# Altium schematic sheet Interface_RS485.SchDoc
size 114 x 55 mm
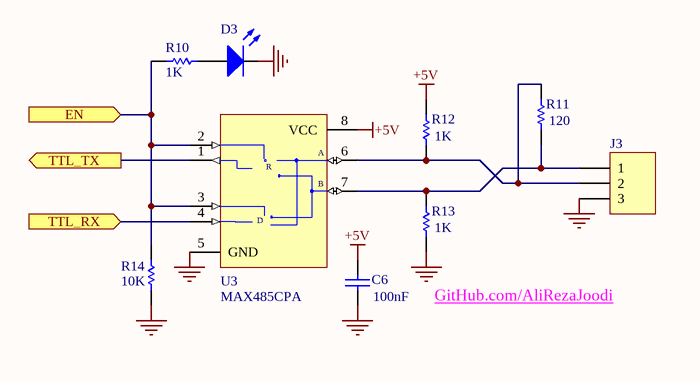
[diagram p0: Interface_RS485.SchDoc]

## Parts
C6  value 100nF  [CAPNTO2.54-3.05x1.78A]  (hidden comment: Cap)
D3  LED  [LED-5mm_Red]  (value not drawn)
J3  Header 3  [Fonics_3PIN_1]  (value not drawn)
R10  value 1K  [AXIAL-0.4]  (hidden comment: Resistor)
R11  value 120  [AXIAL-0.4]  (hidden comment: Res1)
R12  value 1K  [AXIAL-0.4]  (hidden comment: Res1)
R13  value 1K  [AXIAL-0.4]  (hidden comment: Res1)
R14  value 10K  [AXIAL-0.4]  (hidden comment: Res1)
U3  MAX485CPA  [PA8]

## Ports
EN (in), TTL_RX (in), TTL_TX (out)

## Nets
+5V: C6.1 R12.1 U3.8(VCC)
GND: C6.2 D3.2(K) J3.3 R13.2 R14.1 U3.5(GND)
EN: R10.2 R14.2 U3.2(~{RE}) U3.3(DE) ; port EN
TTL_RX: U3.4(DI) ; port TTL_RX
TTL_TX: U3.1(RO) ; port TTL_TX
NetD3_1: D3.1(A) R10.1
NetJ3_1: J3.1 R11.2 R13.1 U3.7(B)
NetJ3_2: J3.2 R11.1 R12.2 U3.6(A)

## Notes on the sheet
- GitHub.com/AliRezaJoodi
- (in symbol MAX485CPA) R; D

## Library data of the parts
C6 = Cap: Capacitor; Published: 8-Jun-2000; LatestRevisionDate: 17-Jul-2002; LatestRevisionNote: Re-released for DXP Platform.; PackageReference: RAD-0.3; Publisher: Altium Limited
D3 = LED: Typical INFRARED GaAs LED; Manufacturer: Generic Components; Class I: Optoelectronic; Published: 8-Jun-2000; Revision: July-2002: Re-released for DXP Platform.; Publisher: Altium Limited; Class II: LED
J3 = Header 3: Header, 3-Pin; Manufacturer: Generic Components; Class I: Connector; Revision: July-2002: Re-released for DXP Platform.; Publisher: Altium Limited
R10 = Res1: Manufacturer: Generic Components; Class I: Passive; Published: 8-Jun-2000; Revision: July-2002: Re-released for DXP Platform.; Publisher: Altium Limited; Class II: Resistor
R11-R14 = Res1: Resistor; Published: 8-Jun-2000; LatestRevisionDate: 17-Jul-2002; LatestRevisionNote: Re-released for DXP Platform.; PackageReference: AXIAL-0.3; Publisher: Altium Limited
U3 = MAX485CPA: Low-Power, Slew-Rate-Limited RS-485/RS-422 Transceiver; Published: 16-Jan-2001; LatestRevisionDate: 29-May-2009; LatestRevisionNote: Component Body Added.; DatasheetVersion: Feb-1996; PackageVersion: RevB, 21-0043; PackageReference: PA8; Publisher: Altium Limited; PackageDescription: DIP, 8-Pin, Row Spacing 7.62 mm, Pitch 2.54 mm; Code_JEDEC: MS-001-AB; ComponentLink1Description: Manufacturer Link; ComponentLink1URL: http://www.maxim-ic.com/; ComponentLink2Description: Datasheet; ComponentLink2URL: http://pdfserv.maxim-ic.com/en/ds/MAX1487-MAX491.pdf